# Altium schematic sheet connectV1.1.SchDoc
size A4; SheetNumber: 3; SheetTotal: 3
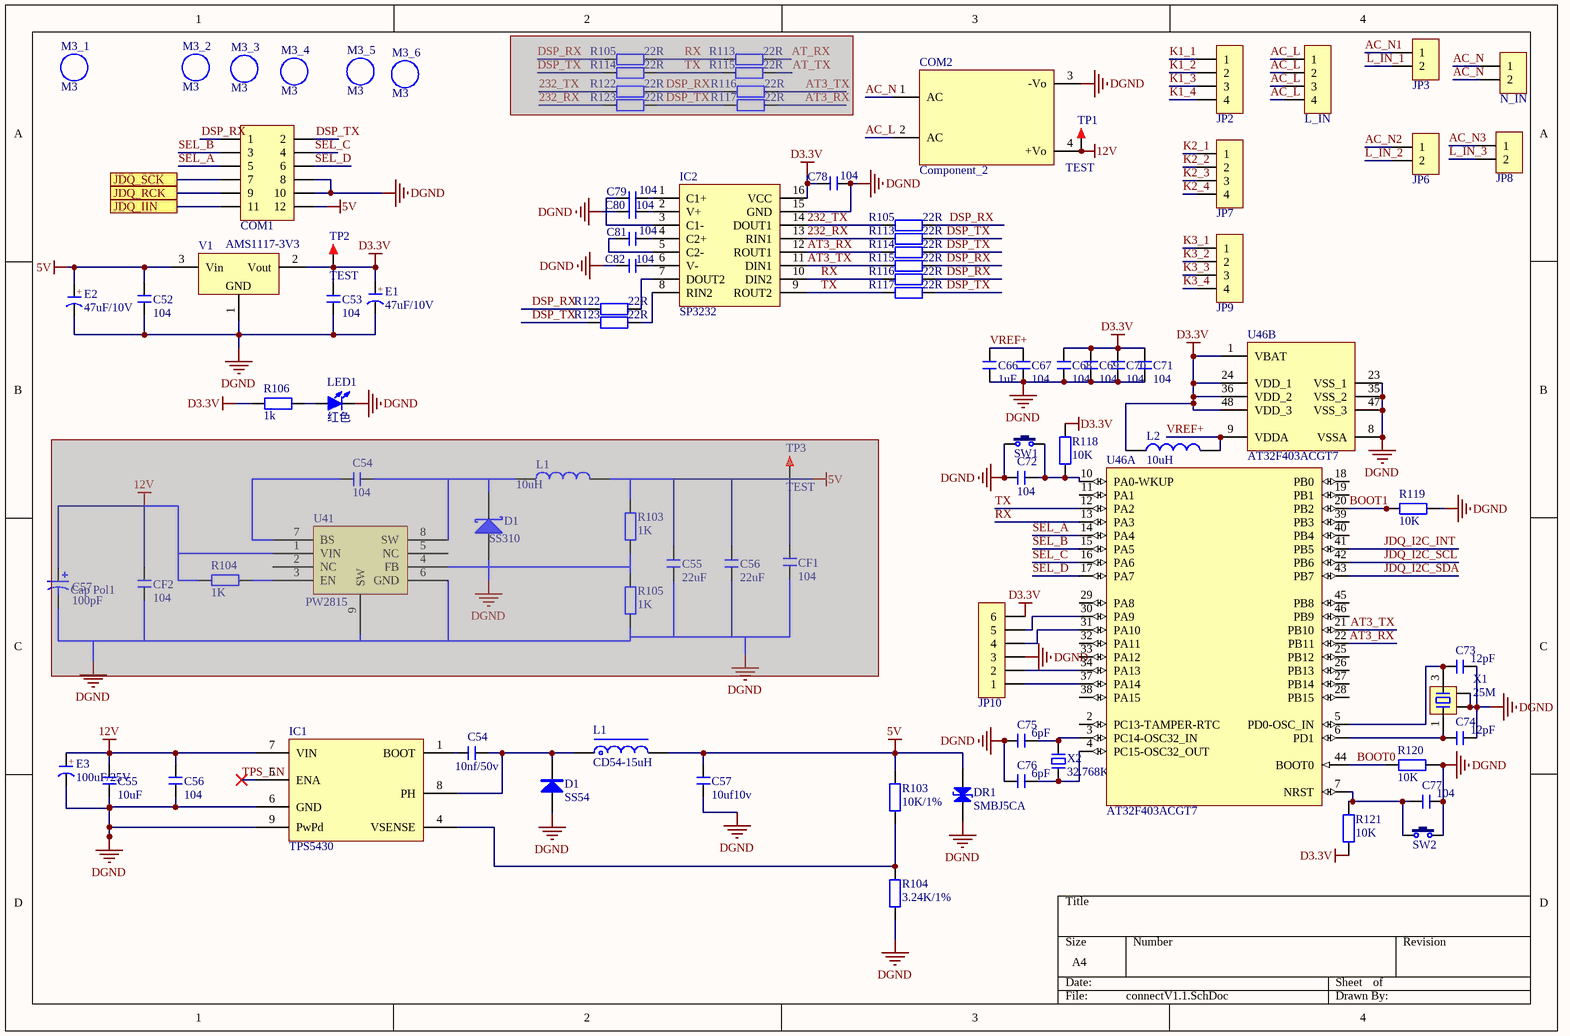
[diagram p0: connectV1.1.SchDoc]

## Parts
(Parts that share a designator on the sheet are numbered #1, #2 ... from top to bottom, then left to right.)
C52  104  [C 0805_L]
C53  104  [C 0805_L]
C54#1  104  [C 0805_L]  (masked out: inside a compile mask, not in the netlist)
C54#2  10nf/50v  [C 0603_L]
C55#1  22uF  [C 0805_M]  (masked out: inside a compile mask, not in the netlist)
C55#2  10uF  [C 0805_L]
C56#1  22uF  [C 0805_M]  (masked out: inside a compile mask, not in the netlist)
C56#2  104  [C 0603_L]
C57#1  Cap Pol1  value 100pF  [RB7.6-15]  (masked out: inside a compile mask, not in the netlist)
C57#2  10uf10v  [C 0603_L]
C66  1uF  [C 0603_L]
C67  104  [C 0603_L]
C68  104  [C 0603_L]
C69  104  [C 0603_L]
C70  104  [C 0603_L]
C71  104  [C 0603_L]
C72  104  [C 0603_L]
C73  12pF  [C 0603_L]
C74  12pF  [C 0603_L]
C75  6pF  [C 0603_L]
C76  6pF  [C 0603_L]
C77  104  [C 0603_L]
C78  104  [C 0603_L]
C79  104  [C 0603_L]
C80  104  [C 0603_L]
C81  104  [C 0603_L]
C82  104  [C 0603_L]
CF1  104  [C 0805_L]  (masked out: inside a compile mask, not in the netlist)
CF2  104  [C 0805_L]  (masked out: inside a compile mask, not in the netlist)
COM1  Header 6X2  [PHD2.0-LI-2x8P]  (value not drawn)
COM2  Component_2  [HLINK-PM12]
D1#1  SS310  [SMB]  (masked out: inside a compile mask, not in the netlist)
D1#2  SS54  [SMB]
DR1  SMBJ5CA  [TVS_SMB]
E1  47uF/10V  [CD C(6032)]
E2  47uF/10V  [CD C(6032)]
E3  100uF/25V  [CM D(6.3*7.7)]
IC1  TPS5430  [SOP8]
IC2  SP3232  [TSSOP16_N]
JP2  HDR-1X4  [KF7620-4P]  (value not drawn)
JP3  HDR-1X2  [KF7620-2P]  (value not drawn)
JP6  HDR-1X2  [KF7620-2P]  (value not drawn)
JP7  HDR-1X4  [KF7620-4P]  (value not drawn)
JP8  HDR-1X2  [KF7620-2P]  (value not drawn)
JP9  HDR-1X4  [KF7620-4P]  (value not drawn)
JP10  HDR-1X6  [HDR2.54-LI-6P]  (value not drawn)
L1#1  10uH  [AL0204]  (masked out: inside a compile mask, not in the netlist)
L1#2  CD54-15uH  [CDRH74]
L2  10uH  [L 0603]
L_IN  HDR-1X4  [KF7620-4P]  (value not drawn)
LED1  红色  [LED 0603R]
M3_1  M3  [M3 125X200]
M3_2  M3  [M3 125X200]
M3_3  M3  [M3 125X200]
M3_4  M3  [M3 125X200]
M3_5  M3  [M3 125X200]
M3_6  M3  [M3 125X200]
N_IN  HDR-1X2  [KF7620-2P]  (value not drawn)
R103#1  1K  [R 0805_L]  (masked out: inside a compile mask, not in the netlist)
R103#2  10K/1%  [R 0603_L]
R104#1  1K  [R 0805_L]  (masked out: inside a compile mask, not in the netlist)
R104#2  3.24K/1%  [R 0603_L]
R105#1  22R  [R 0603_L]  (masked out: inside a compile mask, not in the netlist)
R105#2  22R  [R 0603_L]
R105#3  1K  [R 0805_L]  (masked out: inside a compile mask, not in the netlist)
R106  1k  [R 0603_M]
R113#1  22R  [R 0603_L]  (masked out: inside a compile mask, not in the netlist)
R113#2  22R  [R 0603_L]
R114#1  22R  [R 0603_L]  (masked out: inside a compile mask, not in the netlist)
R114#2  22R  [R 0603_L]
R115#1  22R  [R 0603_L]  (masked out: inside a compile mask, not in the netlist)
R115#2  22R  [R 0603_L]
R116#1  22R  [R 0603_L]  (masked out: inside a compile mask, not in the netlist)
R116#2  22R  [R 0603_L]
R117#1  22R  [R 0603_L]  (masked out: inside a compile mask, not in the netlist)
R117#2  22R  [R 0603_L]
R118  10K  [R 0603_L]
R119  10K  [R 0603_L]
R120  10K  [R 0603_L]
R121  10K  [R 0603_L]
R122#1  22R  [R 0603_L]  (masked out: inside a compile mask, not in the netlist)
R122#2  22R  [R 0603_L]
R123#1  22R  [R 0603_L]  (masked out: inside a compile mask, not in the netlist)
R123#2  22R  [R 0603_L]
SW1  3x6x5  [TSW SMD-3*6*2.5]  (value not drawn)
SW2  3x6x5  [TSW SMD-3*6*2.5]  (value not drawn)
TP1  TEST  [TEST 1.6]
TP2  TEST  [TEST 1.6]
TP3  TEST  [TEST 1.6]  (masked out: inside a compile mask, not in the netlist)
U41  PW2815  [ESOP8_N]  (masked out: inside a compile mask, not in the netlist)
U46  AT32F403ACGT7  [LQFP48_N]  (parts A,B of 2)
V1  AMS1117-3V3  [SOT223_L]
X1  25M  [OSC 3225-4P]
X2  32.768K  [OSC 3215-2P]

## Ports
JDQ_IIN, JDQ_RCK, JDQ_SCK

## Nets
5V: C52.2 C57#2.2 COM1.12 DR1.1(A) E2.1(A) L1#2.2 R103#2.2 V1.3(Vin)
12V: C55#2.2 C56#2.2 COM2.4(+Vo) E3.1(A) IC1.7(VIN) TP1.1
D3.3V: C53.2 C68.2 C69.2 C70.2 C71.2 C78.2 E1.1(A) IC2.16(VCC) JP10.6 L2.1 R106.1 R118.2 R121.2 TP2.1 U46.1(VBAT) U46.24(VDD_1) U46.36(VDD_2) U46.48(VDD_3) V1.2(Vout)
DGND: C52.1 C53.1 C55#2.1 C56#2.1 C57#2.1 C66.1 C67.1 C68.1 C69.1 C70.1 C71.1 C72.1 C73.1 C74.1 C75.2 C76.2 C77.1 C78.1 C80.1 C82.1 COM1.8 COM1.10 COM2.3(-Vo) D1#2.1(A) DR1.2(K) E1.2(K) E2.2(K) E3.2(K) IC1.6(GND) IC1.9(PwPd) IC2.15(GND) JP10.3 LED1.2(K) R104#2.2 R119.1 R120.1 SW1.1 SW2.2 U46.8(VSSA) U46.23(VSS_1) U46.35(VSS_2) U46.47(VSS_3) V1.1(GND) X1.2 X1.4
232_RX: IC2.13(RIN1) R113#2.2
232_TX: IC2.14(DOUT1) R105#2.2
AC_L: COM2.2(AC) L_IN.1 L_IN.2 L_IN.3 L_IN.4
AC_N: COM2.1(AC) N_IN.1 N_IN.2
AC_N1: JP3.1
AC_N2: JP6.1
AC_N3: JP8.1
AT3_RX: IC2.12(ROUT1) R114#2.2 U46.22(PB11)
AT3_TX: IC2.11(DIN1) R115#2.2 U46.21(PB10)
BOOT0: R120.2 U46.44(BOOT0)
BOOT1: R119.2 U46.20(PB2)
DSP_RX: COM1.1 R105#2.1 R115#2.1 R116#2.1 R122#2.2
DSP_TX: COM1.2 R113#2.1 R114#2.1 R117#2.1 R123#2.2
JDQ_I2C_INT: U46.41(PB5)
JDQ_I2C_SCL: U46.42(PB6)
JDQ_I2C_SDA: U46.43(PB7)
JDQ_IIN: COM1.11 ; port JDQ_IIN
JDQ_RCK: COM1.9 ; port JDQ_RCK
JDQ_SCK: COM1.7 ; port JDQ_SCK
K1_1: JP2.1
K1_2: JP2.2
K1_3: JP2.3
K1_4: JP2.4
K2_1: JP7.1
K2_2: JP7.2
K2_3: JP7.3
K2_4: JP7.4
K3_1: JP9.1
K3_2: JP9.2
K3_3: JP9.3
K3_4: JP9.4
L_IN_1: JP3.2
L_IN_2: JP6.2
L_IN_3: JP8.2
RX: IC2.10(DIN2) R116#2.2 U46.13(PA3)
SEL_A: COM1.5 U46.14(PA4)
SEL_B: COM1.3 U46.15(PA5)
SEL_C: COM1.4 U46.16(PA6)
SEL_D: COM1.6 U46.17(PA7)
TPS_EN: IC1.5(ENA)
TX: IC2.9(ROUT2) R117#2.2 U46.12(PA2)
VREF+: C66.2 C67.2 L2.2 U46.9(VDDA)
NetC54#2_1: C54#2.1 IC1.1(BOOT)
NetC54#2_2: C54#2.2 D1#2.2(K) IC1.8(PH) L1#2.1
NetC72_2: C72.2 R118.1 SW1.2 U46.10(PA0-WKUP)
NetC73_2: C73.2 U46.5(PD0-OSC_IN) X1.3
NetC74_2: C74.2 U46.6(PD1) X1.1
NetC75_1: C75.1 U46.3(PC14-OSC32_IN) X2.2
NetC76_1: C76.1 U46.4(PC15-OSC32_OUT) X2.1
NetC77_2: C77.2 R121.1 SW2.1 U46.7(NRST)
NetC79_1: C79.1 IC2.1(C1+)
NetC79_2: C79.2 IC2.3(C1-)
NetC80_2: C80.2 IC2.2(V+)
NetC81_1: C81.1 IC2.4(C2+)
NetC81_2: C81.2 IC2.5(C2-)
NetC82_2: C82.2 IC2.6(V-)
NetIC1_4: IC1.4(VSENSE) R103#2.1 R104#2.1
NetIC2_7: IC2.7(DOUT2) R122#2.1
NetIC2_8: IC2.8(RIN2) R123#2.1
NetJP10_1: JP10.1 U46.37(PA14)
NetJP10_2: JP10.2 U46.34(PA13)
NetJP10_4: JP10.4 U46.31(PA10)
NetJP10_5: JP10.5 U46.30(PA9)
NetLED1_1: LED1.1(A) R106.2

Not connected (* = marked no-connect by the designer): U46 2(PC13-TAMPER-RTC) 11(PA1) 18(PB0) 19(PB1) 25(PB12) 26(PB13) 27(PB14) 28(PB15) 29(PA8) 32(PA11) 33(PA12) 38(PA15) 39(PB3) 40(PB4) 45(PB8) 46(PB9)

## Notes on the sheet
- (in symbol C-CD) +
- (in symbol C-CM) +

## Library data of the parts
C52 C53 C54#2 C55#1 C55#2 C56#1 C56#2 C57#2 C66-C82 = C: 无极性贴片电容; 版权归属: 源创客; BOM名称: 无极性贴片电容; 学习资源: www.ooocke.com
C54#1 CF1 CF2 = C: 贴片电容; BOM名称: 无极性贴片电容; 淘宝ID: 封装库来自淘宝 ID：黄晶宝石; 联系售后，技术支持: https://shop463601444.taobao.com; 唯一出售店铺网址: https://shop463601444.taobao.com
C57#1 = Cap Pol1: Polarized Capacitor (Radial); Published: 8-Jun-2000; LatestRevisionDate: 17-Jul-2002; LatestRevisionNote: Re-released for DXP Platform.; PackageReference: RB7.6-15; Publisher: Altium Limited; PackageDescription: Polarized Capacitor (Radial); 2 Leads
COM1 = Header  6X2: 6*2P接插件; 版权归属: 源创客; BOM名称: 6*2P接插件; 学习资源: www.ooocke.com
COM2 = Component_2: HI-LINK AC-DC12V电源模块
D1#1 = Diode BAT17: Silicon RF Schottky Diode for Mixer Applications in the VHF/UHF Range; Note: Pin 2 is not connected and not drawn.; Published: 21-Mar-2003; LatestRevisionDate: 29-May-2009; LatestRevisionNote: IPC-7351 Footprint Added.; DatasheetVersion: Oct-1999; PackageVersion: Sep-2001; PackageReference: SOT-23; Publisher: Altium Limited; PackageDescription: 3-Pin SOT-23 Package 0.95 mm Pitch, 2.5 mm Lead Span; ComponentLink1Description: Manufacturer Link; ComponentLink1URL: http://www.infineon.com/; ComponentLink2Description: Datasheet; ComponentLink2URL: http://www.infineon.com/upload/Document/cmc_upload/documents/009/363/bat17series.pdf
D1#2 = 1N5819: 肖特基二极管; 版权归属: 源创客; 属性: 40V/2A; BOM名称: 肖特基二极管; 学习资源: www.ooocke.com
DR1 = DR: 瞬态电压抑制二极管; 版权归属: 源创客; BOM名称: 瞬态电压抑制二极管; 学习资源: www.ooocke.com
E1 E2 = C-CD: 贴片钽电容; 版权归属: 源创客; BOM名称: 贴片钽电容; 学习资源: www.ooocke.com
E3 = C-CM: 贴片电解电容; 版权归属: 源创客; BOM名称: 贴片电解电容; 学习资源: www.ooocke.com
IC1 = TPS5430: DC降压芯片
IC2 = SP3232: RS232通讯芯片; 版权归属: 封装库来自淘宝 ID：黄晶宝石; BOM名称: RS232通讯芯片; 学习资源: https://shop463601444.taobao.com
JP2 JP7 JP9 L_IN = Header 4: 4P接插件; 版权归属: 源创客; BOM名称: 4P接插件; 学习资源: www.ooocke.com
JP3 JP6 JP8 N_IN = Header 2: 2P接插件; 版权归属: 源创客; BOM名称: 2P接插件; 学习资源: www.ooocke.com
JP10 = Header 6: 6P接插件; 版权归属: 封装库来自淘宝 ID：黄晶宝石; BOM名称: 6P接插件; 学习资源: https://shop463601444.taobao.com
L1#1 = L-AL: 色环电感; 淘宝ID: 封装库来自淘宝 ID：黄晶宝石; BOM名称: 色环电感; 学习资源: https://shop463601444.taobao.com
L1#2 = L-CD: 贴片功率电感; BOM名称: 功率电感; 版权归属: 源创客; 学习资源: www.ooocke.com
L2 = L: 小功率贴片电感; 淘宝ID: 封装库来自淘宝 ID：黄晶宝石; 封装库来自淘宝卖家 ID：黄晶宝石: 其他店铺购入均为盗版，不享受售后技术支持服务，请立即申请退款; BOM名称: 小功率贴片电感; 联系售后: https://shop463601444.taobao.com
LED1 = LED-SMD: 贴片LED; 版权归属: 源创客; BOM名称: 贴片LED; 学习资源: www.ooocke.com
M3_1-M3_6 = M3: 铜柱孔; 版权归属: 源创客; BOM名称: 铜柱孔; 学习资源: www.ooocke.com
R103#1 R104#1 R105#3 = R: 贴片电阻; 版权归属: 来自淘宝 ID：黄晶宝石; 封装库来自淘宝卖家 ID：黄晶宝石: 其他店铺购入均为盗版，不享受售后技术支持服务，请立即申请退款; BOM名称: 贴片电阻; 联系售后: https://shop463601444.taobao.com
R103#2 R104#2 R105#1 R105#2 R106 R113#1 R113#2 R114#1 R114#2 R115#1 R115#2 R116#1 R116#2 R117#1 R117#2 R118-R121 R122#1 R122#2 R123#1 R123#2 = R: 贴片电阻; 版权归属: 源创客; BOM名称: 贴片电阻; 学习资源: www.ooocke.com
SW1 SW2 = TSW 3x6: 3x6轻触开关; 版权归属: 封装库来自淘宝 ID：黄晶宝石; BOM名称: 3x6轻触开关; 学习资源: https://shop463601444.taobao.com
TP1-TP3 = TEST: 测试点; 版权归属: 源创客; BOM名称: 测试点; 学习资源: www.ooocke.com
U46 = STM32F103C8T6: STM32 ARM-based 32-bit MCU Performance Line with 64 kB Flash, 20 kB Internal RAM, -40 to +85癈 Temperature, 48-Pin LQFP, Tray; DatasheetVersion: rev13.0, Apr-2011; PackageVersion: rev13, Apr-2011; PackageReference: LQFP48; PackageDescription: 48-Pin Low-Profile Quad Flat Pack, 7 x 7 mm Body, 0.5 mm Pitch (LQFP48); ComponentLink1Description: Manufacturer URL; ComponentLink1URL: http://www.st.com/; ComponentLink2Description: STM32F103 Datasheet; ComponentLink2URL: http://www.st.com/internet/com/TECHNICAL_RESOURCES/TECHNICAL_LITERATURE/DATASHEET/CD00161566.pdf; ComponentLink3Description: STM32 Family Web Page; ComponentLink3URL: www.st.com/stm32; 联系售后: https://shop463601444.taobao.com
V1 = AMS1117: 三端稳压芯片; BOM名称: 稳压芯片; 版权归属: 源创客; 学习资源: www.ooocke.com
X1 = XTAL-4P: 4脚无源晶振; 版权归属: 封装库来自淘宝卖家 ID：黄晶宝石; BOM名称: 4脚无源晶振; 学习资源: https://shop463601444.taobao.com
X2 = XTAL-2P: 2脚无源脚晶振; 版权归属: 封装库来自淘宝卖家 ID：黄晶宝石; BOM名称: 2脚无源脚晶振; 学习资源: https://shop463601444.taobao.com